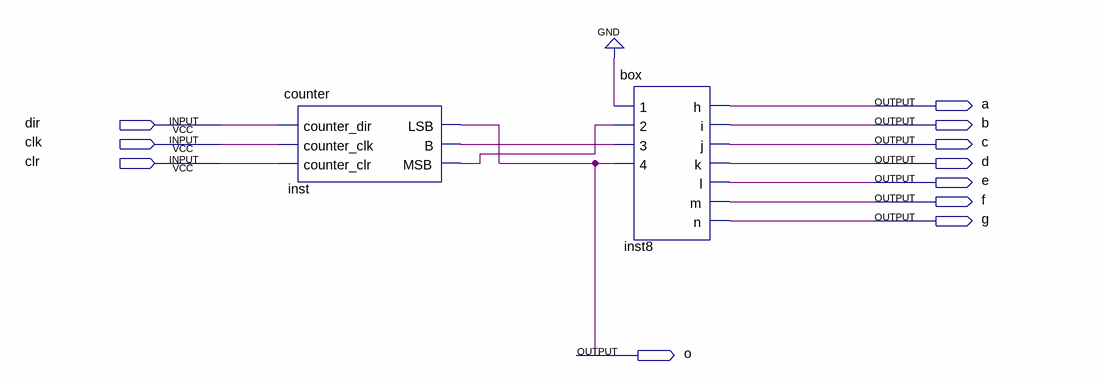
[diagram p0: schematic sheet]
// Quartus schematic bcd.bdf as structural Verilog: 2 symbols, 11 pins
module bcd (
  input  dir,
  input  clk,
  input  clr,
  output a,
  output b,
  output c,
  output d,
  output e,
  output f,
  output g,
  output o
);

  wire inst_b, inst_msb;

  counter inst (.counter_dir(dir), .counter_clk(clk), .counter_clr(clr), .LSB(o), .B(inst_b), .MSB(inst_msb));
  box inst8 (.\1 (1'b0), .\2 (inst_msb), .\3 (inst_b), .\4 (o), .h(a), .i(b), .j(c), .k(d), .l(e), .m(f), .n(g));
endmodule
